# EasyEDA Pro project SAM-2.eprj, schematic WDT_SAM
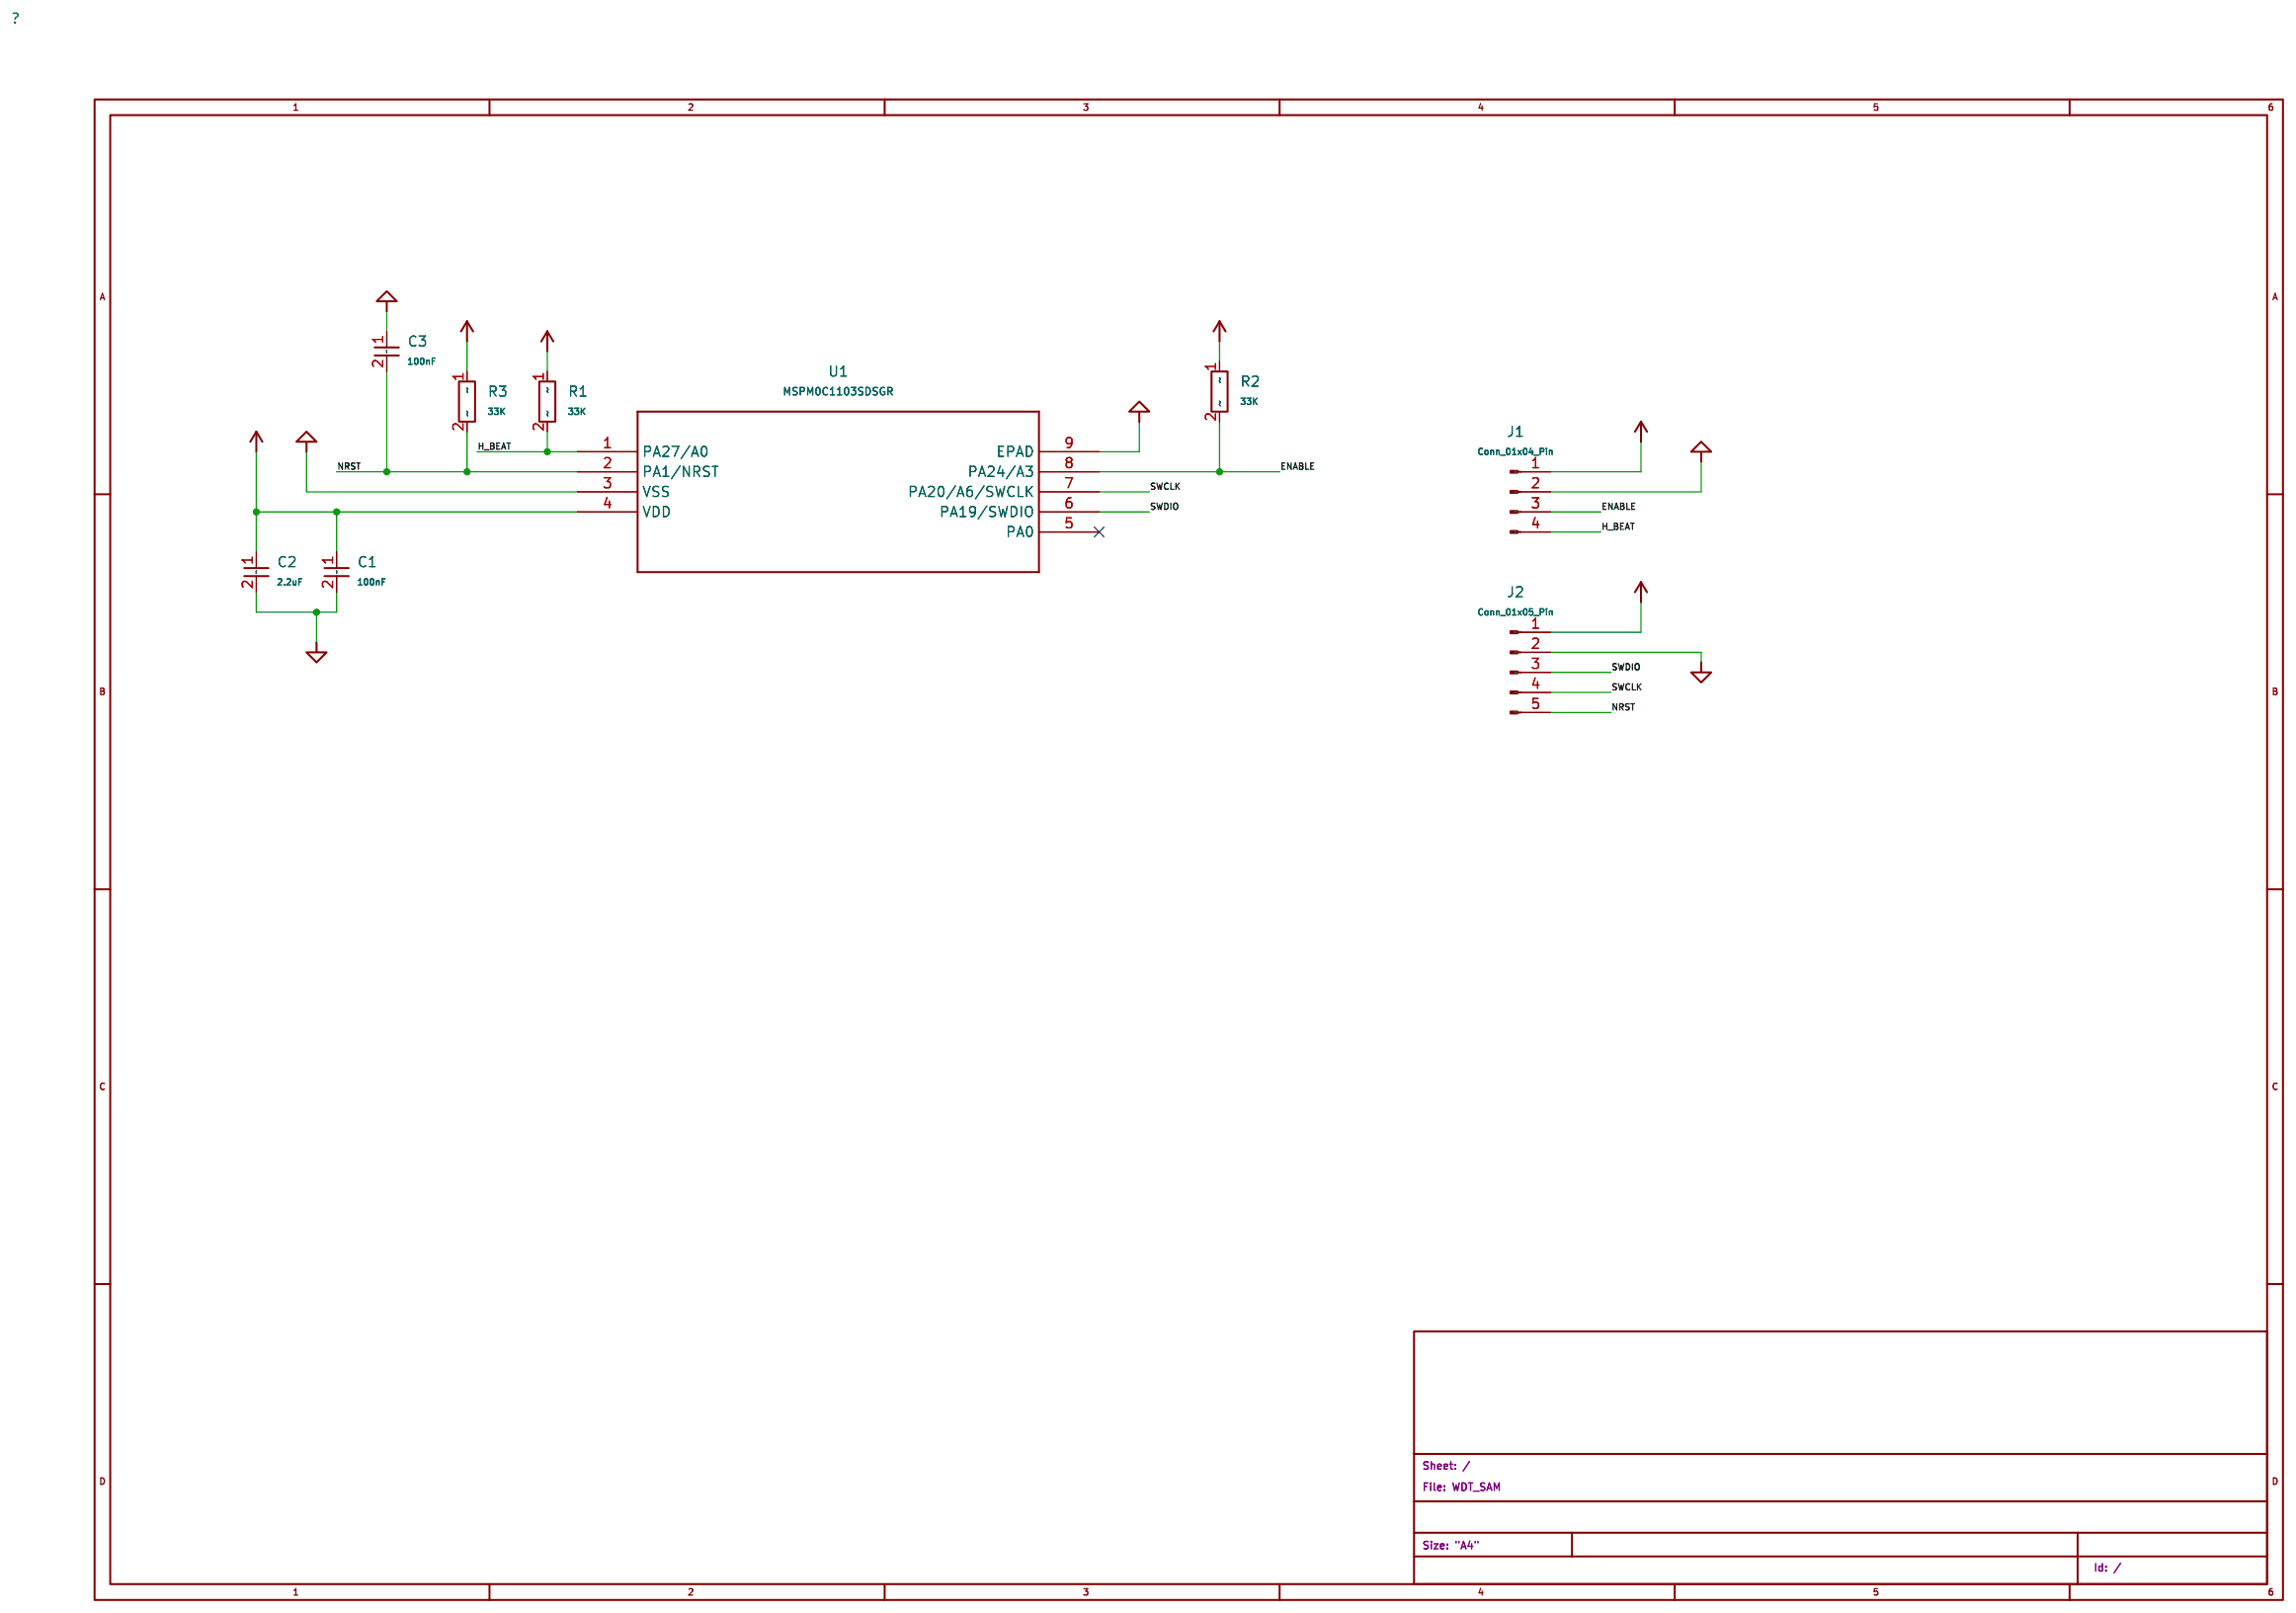
[diagram p8: schematic sheet]

## Parts
C1  100nF  [Capacitor_SMD:C_0603_1608Metric_Pad1.08x0.95mm_HandSolder]
C2  2.2uF  [Capacitor_SMD:C_0603_1608Metric_Pad1.08x0.95mm_HandSolder]
C3  100nF  [Capacitor_SMD:C_0603_1608Metric_Pad1.08x0.95mm_HandSolder]
J1  Conn_01x04_Pin  [Connector_PinHeader_2.54mm:PinHeader_1x04_P2.54mm_Vertical]
J2  Conn_01x05_Pin  [Connector_PinHeader_2.54mm:PinHeader_1x05_P2.54mm_Vertical]
R1  33K  [Resistor_SMD:R_0603_1608Metric_Pad0.98x0.95mm_HandSolder]
R2  33K  [Resistor_SMD:R_0603_1608Metric_Pad0.98x0.95mm_HandSolder]
R3  33K  [Resistor_SMD:R_0603_1608Metric_Pad0.98x0.95mm_HandSolder]
U1  MSPM0C1103SDSGR  [DSG0008A_TEX]

## Library data of the parts
C1 = Device_C_Small: Unpolarized capacitor, small symbol; Attribute1: C3; JLC: C1590
C2 = Device_C_Small: Unpolarized capacitor, small symbol; Attribute1: C3; JLC: C43922
C3 = Device_C_Small: Unpolarized capacitor, small symbol; JLC: C1590
J1 = Connector_Conn_01x04_Pin: Generic connector, single row, 01x04, script generated
J2 = Connector_Conn_01x05_Pin: Generic connector, single row, 01x05, script generated
R1 R2 = Device_R: Resistor; Attribute1: R3; JLC: C4216
R3 = Device_R: Resistor; JLC: C4216
U1 = MSPM0C1103_MSPM0C1103SDSGR: User doc link: https://www.ti.com/lit/gpn/mspm0c1103; JLC: C36387670

## Nets
ENABLE: J1.3(Pin) R2.2 U1.8(PA24/A3)
H_BEAT: J1.4(Pin) R1.2 U1.1(PA27/A0)
NRST: C3.2 J2.5(Pin) R3.2 U1.2(PA1/NRST)
POWER_GND: C1.2 C2.2 C3.1 J1.2(Pin) J2.2(Pin) U1.3(VSS) U1.9(EPAD)
POWER_VDD: C1.1 C2.1 J1.1(Pin) J2.1(Pin) R1.1 R2.1 R3.1 U1.4(VDD)
SWCLK: J2.4(Pin) U1.7(PA20/A6/SWCLK)
SWDIO: J2.3(Pin) U1.6(PA19/SWDIO)

Not connected (* = marked no-connect by the designer): U1 5(PA0)*
